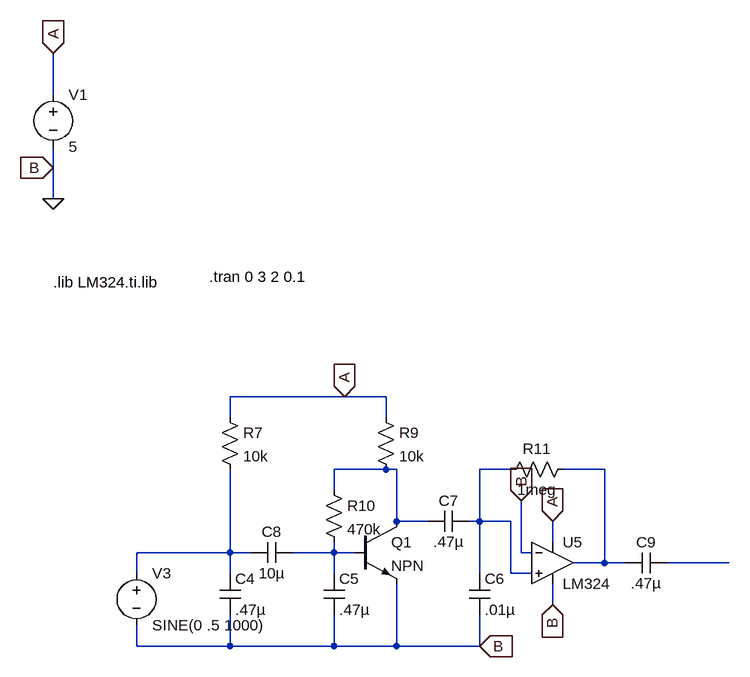
[diagram p0: schematic b.asc]
b.asc, the LTspice schematic file:
Version 4
SHEET 1 880 680
WIRE -1216 -336 -1216 -400
WIRE -1216 -224 -1216 -256
WIRE -1216 -176 -1216 -224
WIRE -768 128 -944 128
WIRE -704 128 -768 128
WIRE -944 160 -944 128
WIRE -704 160 -704 128
WIRE -704 240 -784 240
WIRE -688 240 -704 240
WIRE -512 240 -560 240
WIRE -368 240 -432 240
WIRE -784 272 -784 240
WIRE -688 320 -688 240
WIRE -640 320 -688 320
WIRE -560 320 -560 240
WIRE -560 320 -576 320
WIRE -512 320 -560 320
WIRE -448 352 -448 320
WIRE -944 368 -944 240
WIRE -944 368 -1088 368
WIRE -912 368 -944 368
WIRE -784 368 -784 352
WIRE -784 368 -848 368
WIRE -752 368 -784 368
WIRE -496 368 -496 288
WIRE -480 368 -496 368
WIRE -368 384 -368 240
WIRE -368 384 -416 384
WIRE -336 384 -368 384
WIRE -176 384 -272 384
WIRE -1088 400 -1088 368
WIRE -944 400 -944 368
WIRE -784 400 -784 368
WIRE -560 400 -560 320
WIRE -512 400 -512 320
WIRE -480 400 -512 400
WIRE -448 448 -448 416
WIRE -1088 512 -1088 480
WIRE -944 512 -944 464
WIRE -944 512 -1088 512
WIRE -784 512 -784 464
WIRE -784 512 -944 512
WIRE -688 512 -688 416
WIRE -688 512 -784 512
WIRE -560 512 -560 464
WIRE -560 512 -688 512
FLAG -1216 -176 0
FLAG -1216 -400 A
IOPIN -1216 -400 In
FLAG -1216 -224 B
IOPIN -1216 -224 In
FLAG -448 320 A
IOPIN -448 320 In
FLAG -448 448 B
IOPIN -448 448 In
FLAG -496 288 B
IOPIN -496 288 In
FLAG -768 128 A
IOPIN -768 128 In
FLAG -560 512 B
IOPIN -560 512 In
SYMBOL voltage -1216 -352 R0
WINDOW 123 0 0 Left 2
WINDOW 39 0 0 Left 2
SYMATTR InstName V1
SYMATTR Value 5
SYMBOL res -960 144 R0
SYMATTR InstName R7
SYMATTR Value 10k
SYMBOL res -720 144 R0
SYMATTR InstName R9
SYMATTR Value 10k
SYMBOL res -800 256 R0
SYMATTR InstName R10
SYMATTR Value 470k
SYMBOL res -416 224 R90
WINDOW 0 0 56 VBottom 2
WINDOW 3 32 56 VTop 2
SYMATTR InstName R11
SYMATTR Value 1meg
SYMBOL cap -960 400 R0
SYMATTR InstName C4
SYMATTR Value .47µ
SYMBOL cap -800 400 R0
SYMATTR InstName C5
SYMATTR Value .47µ
SYMBOL cap -576 400 R0
SYMATTR InstName C6
SYMATTR Value .01µ
SYMBOL cap -576 304 R90
WINDOW 0 0 32 VBottom 2
WINDOW 3 32 32 VTop 2
SYMATTR InstName C7
SYMATTR Value .47µ
SYMBOL cap -848 352 R90
WINDOW 0 0 32 VBottom 2
WINDOW 3 32 32 VTop 2
SYMATTR InstName C8
SYMATTR Value 10µ
SYMBOL cap -272 368 R90
WINDOW 0 0 32 VBottom 2
WINDOW 3 32 32 VTop 2
SYMATTR InstName C9
SYMATTR Value .47µ
SYMBOL Opamps\\opamp2 -448 320 R0
SYMATTR InstName U5
SYMATTR Value LM324
SYMBOL npn -752 320 R0
SYMATTR InstName Q1
SYMBOL voltage -1088 384 R0
WINDOW 123 0 0 Left 2
WINDOW 39 0 0 Left 2
SYMATTR InstName V3
SYMATTR Value SINE(0 .5 1000)
TEXT -1216 -48 Left 2 !.lib LM324.ti.lib
TEXT -976 -56 Left 2 !.tran 0 3 2 0.1

The netlist it stands for:
* b.asc
V1 A 0 5
R7 A N004 10k
R9 A N001 10k
R10 N001 N005 470k
R11 N003 N002 1meg
C4 N004 0 .47µ
C5 N005 0 .47µ
C6 N002 0 .01µ
C7 N002 N001 .47µ
C8 N005 N004 10µ
C9 N006 N003 .47µ
XU5 N002 0 A 0 N003 LM324  ; pins In+ In- V+ V- OUT
Q1 N001 N005 0 0 NPN
V3 N004 0 SINE(0 .5 1000)
.model NPN NPN
.model PNP PNP
.lib standard.bjt
.lib LM324.ti.lib
.tran 0 3 2 0.1
.backanno
.end